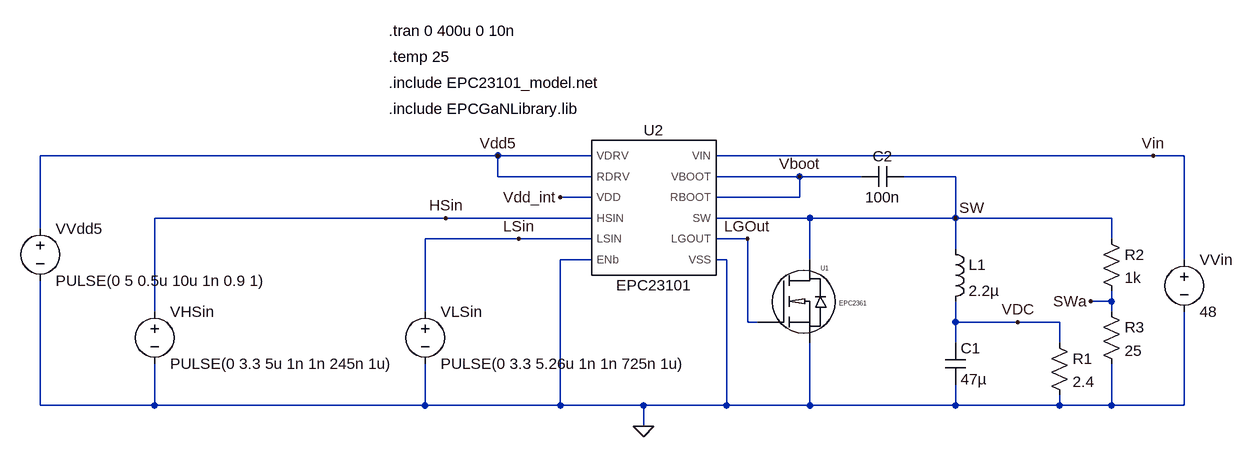
[diagram p0: schematic EPC23101_sim.asc]
EPC23101_sim.asc, the LTspice schematic file:
Version 4.1
SHEET 1 1808 680
WIRE 672 -128 -32 -128
WIRE 816 -128 672 -128
WIRE 1680 -128 1008 -128
WIRE 1728 -128 1680 -128
WIRE 672 -96 672 -128
WIRE 816 -96 672 -96
WIRE 1136 -96 1008 -96
WIRE 1232 -96 1136 -96
WIRE 1376 -96 1296 -96
WIRE 816 -64 768 -64
WIRE 1136 -64 1136 -96
WIRE 1136 -64 1008 -64
WIRE 592 -32 144 -32
WIRE 816 -32 592 -32
WIRE 1152 -32 1008 -32
WIRE 1376 -32 1376 -96
WIRE 1376 -32 1152 -32
WIRE 1616 -32 1376 -32
WIRE -32 -16 -32 -128
WIRE 704 0 560 0
WIRE 816 0 704 0
WIRE 1056 0 1008 0
WIRE 1616 0 1616 -32
WIRE 1376 16 1376 -32
WIRE 816 32 768 32
WIRE 1024 32 1008 32
WIRE 1152 32 1152 -32
WIRE 1728 32 1728 -128
WIRE 1616 96 1616 80
WIRE 1616 96 1584 96
WIRE 144 112 144 -32
WIRE 560 112 560 0
WIRE 1616 112 1616 96
WIRE 1056 128 1056 0
WIRE 1072 128 1056 128
WIRE 1376 128 1376 96
WIRE 1472 128 1376 128
WIRE 1536 128 1472 128
WIRE 1376 160 1376 128
WIRE 1536 160 1536 128
WIRE -32 256 -32 64
WIRE 144 256 144 192
WIRE 144 256 -32 256
WIRE 560 256 560 192
WIRE 560 256 144 256
WIRE 768 256 768 32
WIRE 768 256 560 256
WIRE 896 256 768 256
WIRE 1024 256 1024 32
WIRE 1024 256 896 256
WIRE 1152 256 1152 160
WIRE 1152 256 1024 256
WIRE 1376 256 1376 224
WIRE 1376 256 1152 256
WIRE 1536 256 1536 240
WIRE 1536 256 1376 256
WIRE 1616 256 1616 192
WIRE 1616 256 1536 256
WIRE 1728 256 1728 112
WIRE 1728 256 1616 256
WIRE 896 288 896 256
FLAG 896 288 0
FLAG 1472 128 VDC
FLAG 592 -32 HSin
FLAG 704 0 LSin
FLAG 672 -128 Vdd5
FLAG 1680 -128 Vin
FLAG 1136 -96 Vboot
FLAG 1376 -32 SW
FLAG 1056 0 LGOut
FLAG 768 -64 Vdd_int
FLAG 1584 96 SWa
SYMBOL voltage 144 96 R0
WINDOW 123 0 0 Left 0
WINDOW 39 0 0 Left 0
SYMATTR InstName VHSin
SYMATTR Value PULSE(0 3.3 5u 1n 1n 245n 1u)
SYMBOL voltage 560 96 R0
WINDOW 123 0 0 Left 0
WINDOW 39 0 0 Left 0
SYMATTR InstName VLSin
SYMATTR Value PULSE(0 3.3 5.26u 1n 1n 725n 1u)
SYMBOL ind 1360 0 R0
SYMATTR InstName L1
SYMATTR Value 2.2µ
SYMATTR SpiceLine Ipk=25.6 Rser=0.0082 Rpar=0 Cpar=0 mfg="Vishay" pn="IHLP4040DZ01-2R2"
SYMBOL res 1520 144 R0
SYMATTR InstName R1
SYMATTR Value 2.4
SYMBOL cap 1360 160 R0
SYMATTR InstName C1
SYMATTR Value 47µ
SYMBOL cap 1296 -112 R90
WINDOW 0 0 32 VBottom 2
WINDOW 3 32 32 VTop 2
SYMATTR InstName C2
SYMATTR Value 100n
SYMBOL voltage -32 -32 R0
WINDOW 123 0 0 Left 0
WINDOW 39 0 0 Left 0
SYMATTR InstName VVdd5
SYMATTR Value PULSE(0 5 0.5u 10u 1n 0.9 1)
SYMBOL voltage 1728 16 R0
WINDOW 123 0 0 Left 0
WINDOW 39 0 0 Left 0
SYMATTR InstName VVin
SYMATTR Value 48
SYMBOL res 1600 -16 R0
SYMATTR InstName R2
SYMATTR Value 1k
SYMBOL res 1600 96 R0
SYMATTR InstName R3
SYMATTR Value 25
SYMBOL EPC23101_model 912 -48 R0
SYMATTR InstName U2
SYMBOL EPCGaN 1072 128 R0
SYMATTR InstName U1
SYMATTR Value EPC2361
TEXT 504 -320 Left 2 !.tran 0 400u 0 10n
TEXT 504 -240 Left 2 !.include EPC23101_model.net
TEXT 504 -280 Left 2 !.temp 25
TEXT 504 -200 Left 2 !.include EPCGaNLibrary.lib

The netlist it stands for:
* EPC23101_sim.asc
VHSin HSin 0 PULSE(0 3.3 5u 1n 1n 245n 1u)
VLSin LSin 0 PULSE(0 3.3 5.26u 1n 1n 725n 1u)
L1 SW VDC 2.2µ Ipk=25.6 Rser=0.0082 Rpar=0 Cpar=0 mfg="Vishay" pn="IHLP4040DZ01-2R2"
R1 VDC 0 2.4
C1 VDC 0 47µ
C2 SW Vboot 100n
VVdd5 Vdd5 0 PULSE(0 5 0.5u 10u 1n 0.9 1)
VVin Vin 0 48
R2 SW SWa 1k
R3 SWa 0 25
X§U2 0 HSin LSin Vdd5 0 LGOut Vboot Vdd5 SW Vboot Vdd_int Vin EPC23101  ; pins ENb HSIN LSIN VDRV VSS LGOUT RBOOT RDRV SW VBOOT VDD VIN
X§U1 LGOut SW 0 EPC2361  ; pins gatein drainin N_0
.tran 0 400u 0 10n
.include EPC23101_model.net
.temp 25
.include EPCGaNLibrary.lib
.lib EPC\EPCGanLibrary.lib
.backanno
.end